# EasyEDA schematic SCH_picopad_2023-12-01.json
TITLE: Sheet_1; REV: 1.0; Date: 2023-12-01; Sheet: 1/1; Drawn By: glooper; Company: Your Company
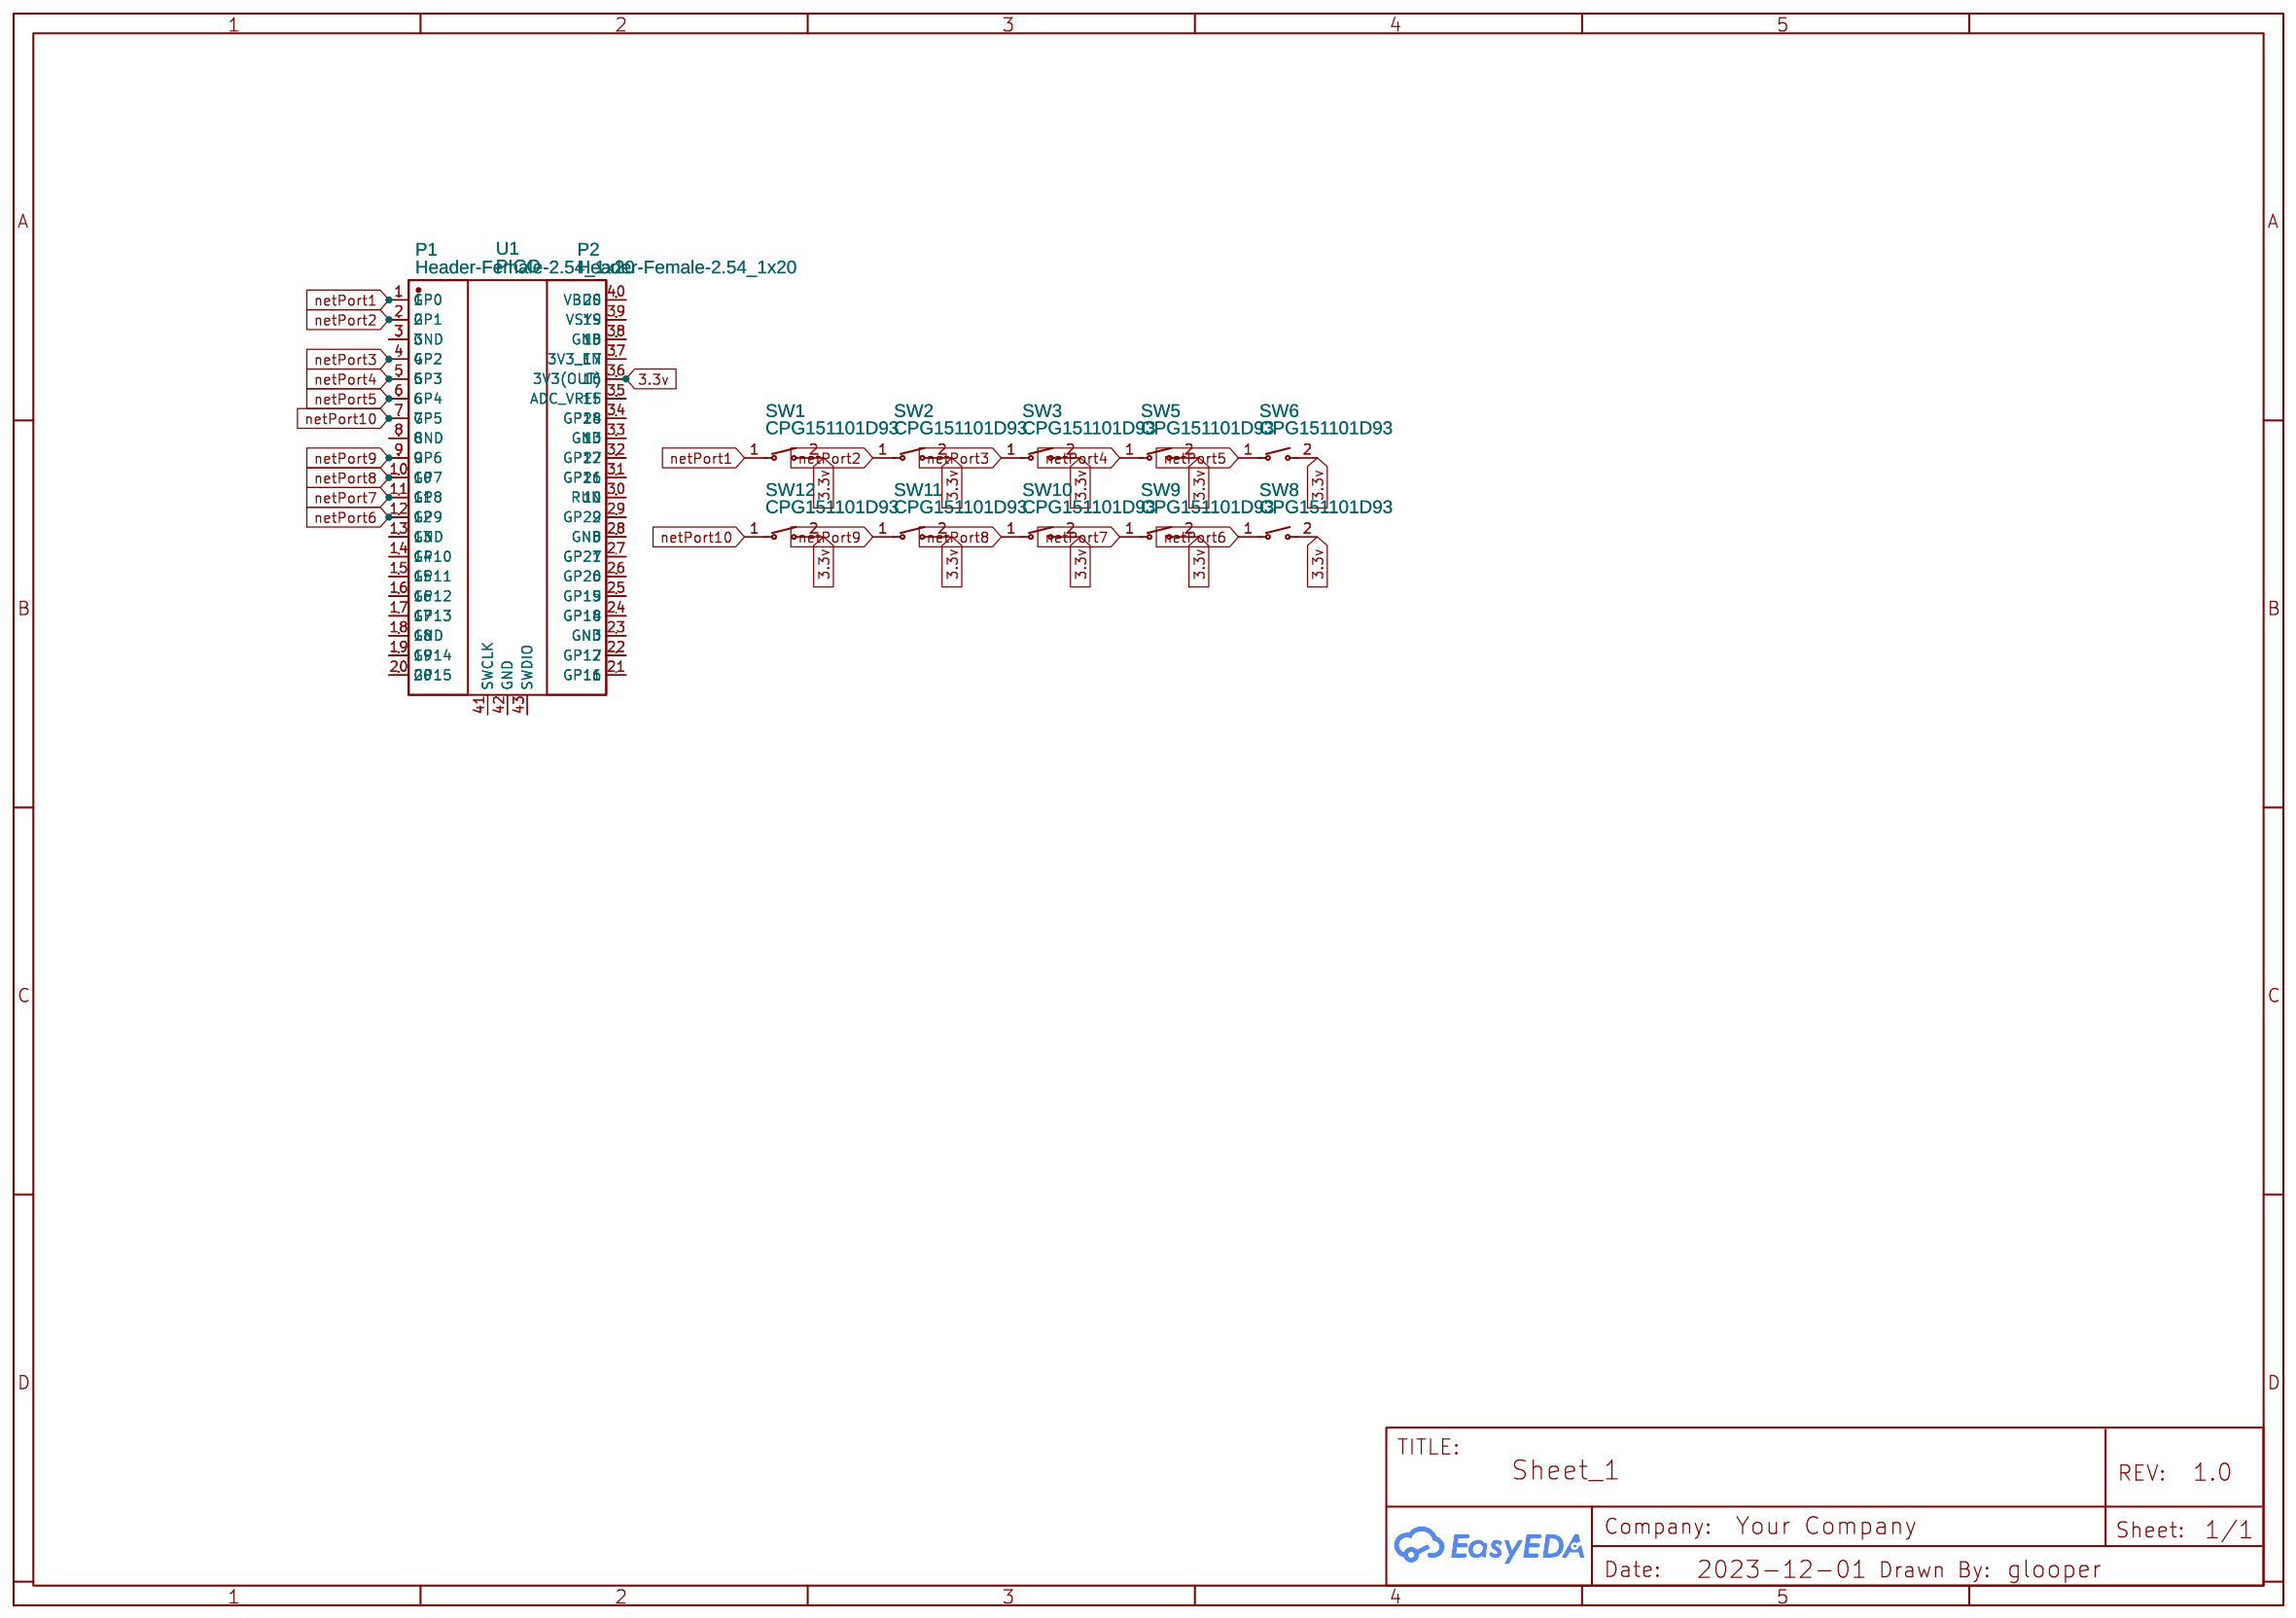
[diagram p0: schematic sheet]

## Parts
P1  Header-Female-2.54_1x20  [HDR-TH_20P-P2.54-V-F]
P2  Header-Female-2.54_1x20  [HDR-TH_20P-P2.54-V-F]
SW1  CPG151101D93  [SW-TH_CPG151101D9X]
SW2  CPG151101D93  [SW-TH_CPG151101D9X]
SW3  CPG151101D93  [SW-TH_CPG151101D9X]
SW5  CPG151101D93  [SW-TH_CPG151101D9X]
SW6  CPG151101D93  [SW-TH_CPG151101D9X]
SW8  CPG151101D93  [SW-TH_CPG151101D9X]
SW9  CPG151101D93  [SW-TH_CPG151101D9X]
SW10  CPG151101D93  [SW-TH_CPG151101D9X]
SW11  CPG151101D93  [SW-TH_CPG151101D9X]
SW12  CPG151101D93  [SW-TH_CPG151101D9X]
U1  PICO  [COMM-SMD_L51.0-W21.0-P2.54_SC0916]

## Library data of the parts
P1 P2 = Header-Female-2.54_1x20: Supplier: LCSC; Manufacturer: BOOMELE(博穆精密); Manufacturer Part: 2.54-1*20P母; Supplier Part: C50984; JLCPCB Part Class: Extended Part; link: https://lcsc.com/eda_search?q=C50984&%26type=1&ref=editor
SW1-SW3 SW5 SW6 SW8-SW12 = CPG151101D93: Contributor: LCSC; Supplier: LCSC; Supplier Part: C400237; Manufacturer: Kailh(凯华); JLCPCB Part Class: Extended Part; link: https://lcsc.com/eda_search?q=C400237&%26type=1&ref=editor
U1 = PICO: Supplier: LCSC; Supplier Part: C7203002; Manufacturer: Raspberry Pi(树莓派); JLCPCB Part Class: Extended Part; Contributor: lcsc; link: https://lcsc.com/eda_search?q=C7203002&%26type=1&ref=editor

## Nets
3.3v: P2.16 SW1.2 SW2.2 SW3.2 SW5.2 SW6.2 SW8.2 SW9.2 SW10.2 SW11.2 SW12.2 U1.36(3V3(OUT))
netPort1: P1.1 SW1.1 U1.1(GP0)
netPort2: P1.2 SW2.1 U1.2(GP1)
netPort3: P1.4 SW3.1 U1.4(GP2)
netPort4: P1.5 SW5.1 U1.5(GP3)
netPort5: P1.6 SW6.1 U1.6(GP4)
netPort6: P1.12 SW8.1 U1.12(GP9)
netPort7: P1.11 SW9.1 U1.11(GP8)
netPort8: P1.10 SW10.1 U1.10(GP7)
netPort9: P1.9 SW11.1 U1.9(GP6)
netPort10: P1.7 SW12.1 U1.7(GP5)
Net-(P1-3): P1.3 U1.3(GND)
Net-(P1-8): P1.8 U1.8(GND)
Net-(P1-13): P1.13 U1.13(GND)
Net-(P1-14): P1.14 U1.14(GP10)
Net-(P1-15): P1.15 U1.15(GP11)
Net-(P1-16): P1.16 U1.16(GP12)
Net-(P1-17): P1.17 U1.17(GP13)
Net-(P1-18): P1.18 U1.18(GND)
Net-(P1-19): P1.19 U1.19(GP14)
Net-(P1-20): P1.20 U1.20(GP15)
Net-(P2-1): P2.1 U1.21(GP16)
Net-(P2-2): P2.2 U1.22(GP17)
Net-(P2-3): P2.3 U1.23(GND)
Net-(P2-4): P2.4 U1.24(GP18)
Net-(P2-5): P2.5 U1.25(GP19)
Net-(P2-6): P2.6 U1.26(GP20)
Net-(P2-7): P2.7 U1.27(GP21)
Net-(P2-8): P2.8 U1.28(GND)
Net-(P2-9): P2.9 U1.29(GP22)
Net-(P2-10): P2.10 U1.30(RUN)
Net-(P2-11): P2.11 U1.31(GP26)
Net-(P2-12): P2.12 U1.32(GP27)
Net-(P2-13): P2.13 U1.33(GND)
Net-(P2-14): P2.14 U1.34(GP28)
Net-(P2-15): P2.15 U1.35(ADC_VREF)
Net-(P2-17): P2.17 U1.37(3V3_EN)
Net-(P2-18): P2.18 U1.38(GND)
Net-(P2-19): P2.19 U1.39(VSYS)
Net-(P2-20): P2.20 U1.40(VBUS)

Not connected (* = marked no-connect by the designer): U1 41(SWCLK) 42(GND) 43(SWDIO)
